# EAGLE schematic uUSB breakout v3 (EAGLE 7.3.0)
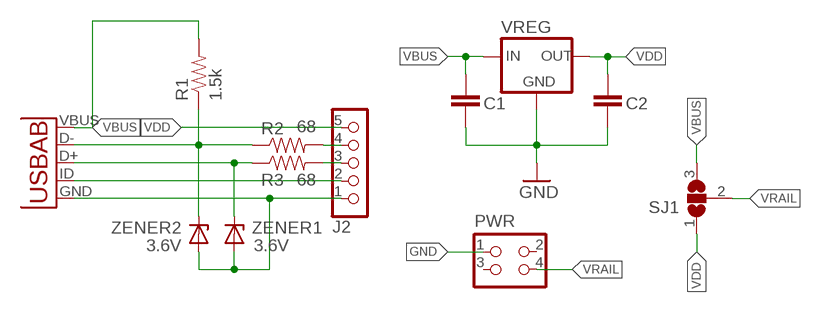
[diagram p0: schematic, sheet 1]

## Parts
C1  CAPACITOR_NPOL-0805  [C805]
C2  CAPACITOR_NPOL-0805  [C805]
J2  CON_HEADER_1X05-PTH  [M1X5]
PWR  CON_HEADER_2X02-PTH  [M2X2]
R1  1.5k  RESISTOR0805-RES  [0805]
R2  68  RESISTOR0805-RES  [0805]
R3  68  RESISTOR0805-RES  [0805]
SJ1  SJ2W  [SJ_2]
UUSB  USB-AB  [USB-AB-MICRO-SMD]
VREG  V_REG_MIC2920  [SOT223]
ZENER1  3.6V  ZENER-DIODESOD80C  [SOD80C]
ZENER2  3.6V  ZENER-DIODESOD80C  [SOD80C]

## Nets
D-: R1.1 R2.1 UUSB.D- ZENER2.C
GND: C1.2 C2.2 J2.1 PWR.1 UUSB.GND VREG.2(GND) VREG.4(GND) ZENER1.A ZENER2.A
ID: J2.2 UUSB.ID(USBID)
N$1: J2.4 R2.2
N$2: J2.3 R3.2
N$3: R3.1 UUSB.D+ ZENER1.C
VBUS: C1.1 R1.2 SJ1.3 UUSB.VBUS VREG.1(IN)
VDD: C2.1 J2.5 SJ1.1 VREG.3(OUT)
VRAIL: PWR.4 SJ1.2
Unconnected: PWR.2 PWR.3

## Library data of the parts
C1 C2 = dp_devices:CAPACITOR_NPOL: Non-Polarized capacitor in various packages
J2 = dp_devices:CON_HEADER_1X05
PWR = dp_devices:CON_HEADER_2X02
R1-R3 = SparkFun-Passives:RESISTOR: Resistor Basic schematic elements and footprints for 0603, 1206, and PTH resistors.
SJ1 = jumper:SJ2W: SMD solder JUMPER
UUSB = SparkFun-Connectors:USB-AB: This is a USB AB connector that is compatible with USB OTG. i.e. this connector can serve as a host or device
VREG = SparkFun-PowerIC:V_REG_MIC2920: MIC2920A (http://www.micrel.com/_PDF/mic2920.pdf) - 400mA output LDO Regulator
ZENER1 ZENER2 = diode:ZENER-DIODE: Z-Diode